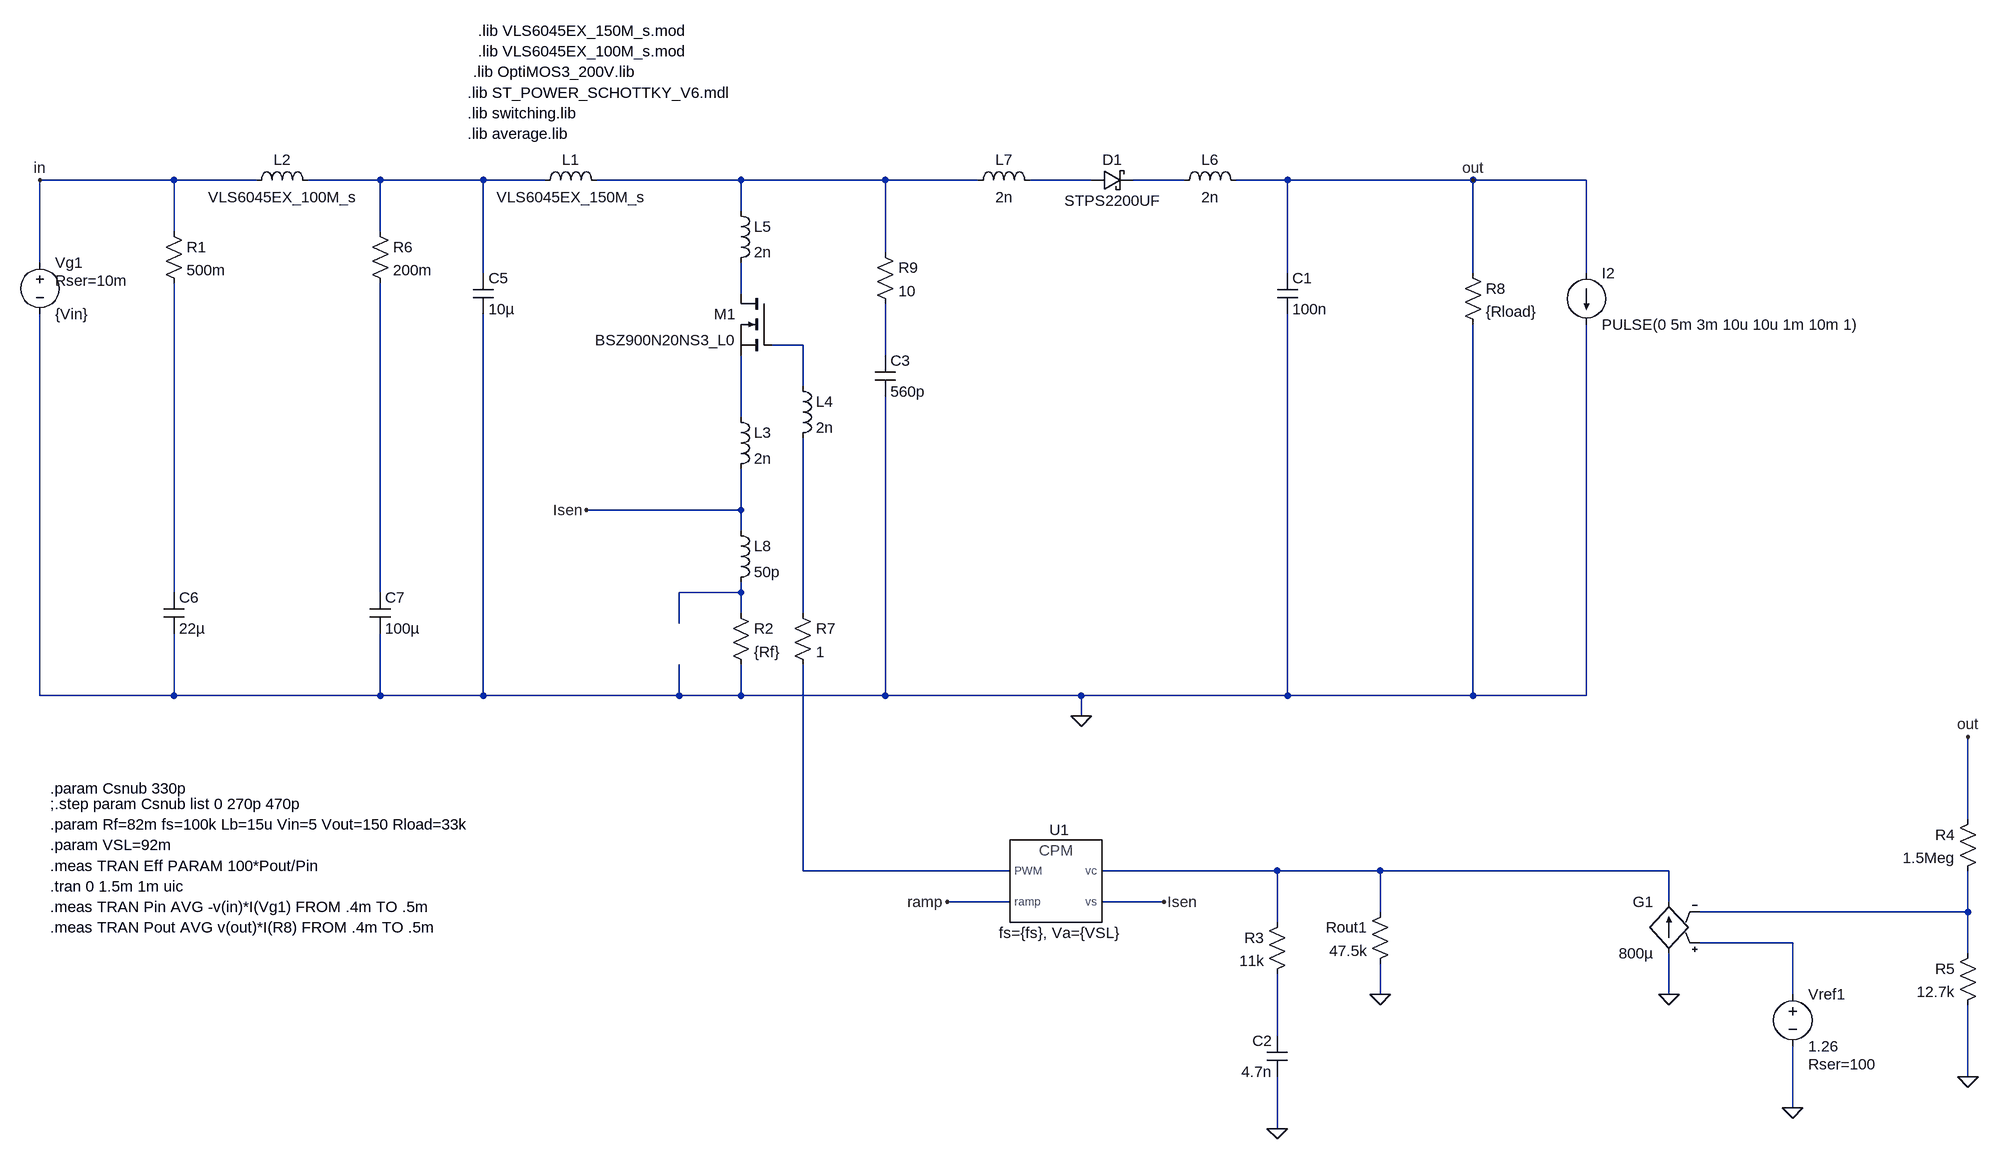
[diagram p0: schematic DCM CPM switching CL.asc]
DCM CPM switching CL.asc, the LTspice schematic file:
Version 4
SHEET 1 2048 1268
WIRE -1536 -224 -1744 -224
WIRE -1408 -224 -1536 -224
WIRE -1216 -224 -1328 -224
WIRE -1056 -224 -1216 -224
WIRE -960 -224 -1056 -224
WIRE -656 -224 -880 -224
WIRE -432 -224 -656 -224
WIRE -288 -224 -432 -224
WIRE -112 -224 -208 -224
WIRE 32 -224 -48 -224
WIRE 192 -224 112 -224
WIRE 480 -224 192 -224
WIRE 656 -224 480 -224
WIRE -656 -176 -656 -224
WIRE -1536 -144 -1536 -224
WIRE -1216 -144 -1216 -224
WIRE -432 -112 -432 -224
WIRE -1744 -96 -1744 -224
WIRE -1056 -80 -1056 -224
WIRE 192 -80 192 -224
WIRE 480 -80 480 -224
WIRE 656 -80 656 -224
WIRE -656 -48 -656 -96
WIRE -560 32 -608 32
WIRE -432 48 -432 -32
WIRE -560 96 -560 32
WIRE -656 144 -656 48
WIRE -656 288 -656 224
WIRE -656 288 -896 288
WIRE -656 320 -656 288
WIRE -1536 416 -1536 -64
WIRE -1216 416 -1216 -64
WIRE -656 416 -656 400
WIRE -656 416 -752 416
WIRE -656 448 -656 416
WIRE -560 448 -560 176
WIRE -752 464 -752 416
WIRE -1744 576 -1744 -16
WIRE -1536 576 -1536 480
WIRE -1536 576 -1744 576
WIRE -1216 576 -1216 480
WIRE -1216 576 -1536 576
WIRE -1056 576 -1056 -16
WIRE -1056 576 -1216 576
WIRE -752 576 -752 528
WIRE -752 576 -1056 576
WIRE -656 576 -656 528
WIRE -656 576 -752 576
WIRE -432 576 -432 112
WIRE -432 576 -656 576
WIRE -128 576 -432 576
WIRE 192 576 192 -16
WIRE 192 576 -128 576
WIRE 480 576 480 0
WIRE 480 576 192 576
WIRE 656 576 656 0
WIRE 656 576 480 576
WIRE -128 608 -128 576
WIRE 1248 768 1248 640
WIRE -560 848 -560 528
WIRE -240 848 -560 848
WIRE 176 848 -96 848
WIRE 336 848 176 848
WIRE 784 848 336 848
WIRE -240 896 -336 896
WIRE 0 896 -96 896
WIRE 784 896 784 848
WIRE 336 912 336 848
WIRE 1248 912 1248 848
WIRE 1248 912 832 912
WIRE 176 928 176 848
WIRE 976 960 832 960
WIRE 1248 976 1248 912
WIRE 336 1040 336 992
WIRE 784 1040 784 976
WIRE 976 1040 976 960
WIRE 176 1104 176 1008
WIRE 1248 1168 1248 1056
WIRE 976 1216 976 1120
WIRE 176 1248 176 1168
FLAG -128 608 0
FLAG -1744 -224 in
FLAG 480 -224 out
FLAG -896 288 Isen
FLAG 0 896 Isen
FLAG -336 896 ramp
FLAG 1248 1168 0
FLAG 1248 640 out
FLAG 976 1216 0
FLAG 784 1040 0
FLAG 336 1040 0
FLAG 176 1248 0
SYMBOL voltage -1744 -112 R0
WINDOW 123 0 0 Left 0
WINDOW 39 24 44 Left 2
SYMATTR SpiceLine Rser=10m
SYMATTR InstName Vg1
SYMATTR Value {Vin}
SYMBOL cap 176 -80 R0
SYMATTR InstName C1
SYMATTR Value 100n
SYMBOL ind -976 -208 R270
WINDOW 0 32 56 VTop 2
WINDOW 3 5 56 VBottom 2
SYMATTR InstName L1
SYMATTR Value VLS6045EX_150M_s
SYMATTR SpiceLine Rser=75m
SYMATTR Prefix X
SYMBOL CPM_modulator -160 880 M0
SYMATTR InstName U1
SYMATTR SpiceLine fs={fs}, Va={VSL}
SYMBOL nmos -608 -48 M0
SYMATTR InstName M1
SYMATTR Value BSZ900N20NS3_L0
SYMATTR Prefix X
SYMBOL schottky -112 -208 R270
WINDOW 0 32 32 VTop 2
WINDOW 3 0 32 VBottom 2
SYMATTR InstName D1
SYMATTR Value STPS2200UF
SYMATTR Description Diode
SYMATTR Type diode
SYMBOL res -672 432 R0
SYMATTR InstName R2
SYMATTR Value {Rf}
SYMBOL res 1264 752 M0
SYMATTR InstName R4
SYMATTR Value 1.5Meg
SYMBOL res 1264 960 M0
SYMATTR InstName R5
SYMATTR Value 12.7k
SYMBOL current 656 -80 R0
WINDOW 123 0 0 Left 0
WINDOW 39 0 0 Left 0
SYMATTR InstName I2
SYMATTR Value PULSE(0 5m 3m 10u 10u 1m 10m 1)
SYMBOL voltage 976 1024 R0
WINDOW 123 0 0 Left 0
WINDOW 39 24 124 Left 2
SYMATTR SpiceLine Rser=100
SYMATTR InstName Vref1
SYMATTR Value 1.26
SYMBOL g2 784 880 M0
SYMATTR InstName G1
SYMATTR Value 800µ
SYMATTR Value2 table=(-.175, -140u) (.138, 110u)
SYMBOL res 352 896 M0
SYMATTR InstName Rout1
SYMATTR Value 47.5k
SYMBOL res 192 912 M0
SYMATTR InstName R3
SYMATTR Value 11k
SYMBOL cap 192 1104 M0
SYMATTR InstName C2
SYMATTR Value 4.7n
SYMBOL cap -1072 -80 R0
SYMATTR InstName C5
SYMATTR Value 10µ
SYMBOL cap -1552 416 R0
SYMATTR InstName C6
SYMATTR Value 22µ
SYMATTR SpiceLine Rser=100m
SYMBOL res -1552 -160 R0
SYMATTR InstName R1
SYMATTR Value 500m
SYMBOL ind -1424 -208 R270
WINDOW 0 32 56 VTop 2
WINDOW 3 5 56 VBottom 2
SYMATTR InstName L2
SYMATTR Value VLS6045EX_100M_s
SYMATTR SpiceLine Rser=50m
SYMATTR Prefix X
SYMBOL cap -1232 416 R0
SYMATTR InstName C7
SYMATTR Value 100µ
SYMATTR SpiceLine Rser=45m
SYMBOL res -1232 -160 R0
SYMATTR InstName R6
SYMATTR Value 200m
SYMBOL res -576 432 R0
SYMATTR InstName R7
SYMATTR Value 1
SYMBOL res 464 -96 R0
SYMATTR InstName R8
SYMATTR Value {Rload}
SYMBOL ind -576 80 R0
SYMATTR InstName L4
SYMATTR Value 2n
SYMBOL ind -672 -192 R0
SYMATTR InstName L5
SYMATTR Value 2n
SYMBOL ind -304 -208 R270
WINDOW 0 32 56 VTop 2
WINDOW 3 5 56 VBottom 2
SYMATTR InstName L7
SYMATTR Value 2n
SYMBOL ind 16 -208 R270
WINDOW 0 32 56 VTop 2
WINDOW 3 5 56 VBottom 2
SYMATTR InstName L6
SYMATTR Value 2n
SYMBOL ind -672 304 R0
SYMATTR InstName L8
SYMATTR Value 50p
SYMBOL ind -672 128 R0
SYMATTR InstName L3
SYMATTR Value 2n
SYMBOL cap -448 48 R0
SYMATTR InstName C3
SYMATTR Value 560p
SYMBOL res -448 -128 R0
SYMATTR InstName R9
SYMATTR Value 10
TEXT -1080 -328 Left 2 !.lib switching.lib
TEXT -1080 -296 Left 2 !.lib average.lib
TEXT -1728 872 Left 2 !.tran 0 1.5m 1m uic
TEXT -1728 776 Left 2 !.param Rf=82m fs=100k Lb=15u Vin=5 Vout=150 Rload=33k
TEXT -1728 808 Left 2 !.param VSL=92m
TEXT -1080 -360 Left 2 !.lib ST_POWER_SCHOTTKY_V6.mdl
TEXT -1728 904 Left 2 !.meas TRAN Pin AVG -v(in)*I(Vg1) FROM .4m TO .5m
TEXT -1728 936 Left 2 !.meas TRAN Pout AVG v(out)*I(R8) FROM .4m TO .5m
TEXT -1728 840 Left 2 !.meas TRAN Eff PARAM 100*Pout/Pin
TEXT -1072 -392 Left 2 !.lib OptiMOS3_200V.lib
TEXT -1064 -424 Left 2 !.lib VLS6045EX_100M_s.mod
TEXT -1064 -456 Left 2 !.lib VLS6045EX_150M_s.mod
TEXT -1728 744 Left 2 !;.step param Csnub list 0 270p 470p
TEXT -1728 720 Left 2 !.param Csnub 330p

The netlist it stands for:
* DCM CPM switching CL.asc
Vg1 in 0 {Vin} Rser=10m
C1 out 0 100n
XL1 N001 N002 VLS6045EX_150M_s Rser=75m  ; pins A B
XU1 N014 Isen N013 ramp CPM_modulator fs={fs}, Va={VSL} Vcmax=5, Dmin=0, Dmax=0.9, Voffset=0  ; pins vc vs PWM ramp
XM1 N005 N006 N008 BSZ900N20NS3_L0  ; pins D G S
D1 N003 N004 STPS2200UF
R2 N011 0 {Rf}
R4 out N015 1.5Meg
R5 N015 0 12.7k
I2 out 0 PULSE(0 5m 3m 10u 10u 1m 10m 1)
Vref1 N016 0 1.26 Rser=100
G1 0 N014 N016 N015 800µ table=(-.175, -140u) (.138, 110u)
Rout1 N014 0 47.5k
R3 N014 N017 11k
C2 N017 0 4.7n
C5 N001 0 10µ
C6 N009 0 22µ Rser=100m
R1 in N009 500m
XL2 in N001 VLS6045EX_100M_s Rser=50m  ; pins A B
C7 N010 0 100µ Rser=45m
R6 N001 N010 200m
R7 N012 N013 1
R8 out 0 {Rload}
L4 N006 N012 2n
L5 N002 N005 2n
L7 N002 N003 2n
L6 N004 out 2n
L8 Isen N011 50p
L3 N008 Isen 2n
C3 N007 0 560p
R9 N002 N007 10
.model D D
.lib standard.dio
.lib switching.lib
.lib average.lib
.tran 0 1.5m 1m uic
.param Rf=82m fs=100k Lb=15u Vin=5 Vout=150 Rload=33k
.param VSL=92m
.lib ST_POWER_SCHOTTKY_V6.mdl
.meas TRAN Pin AVG -v(in)*I(Vg1) FROM .4m TO .5m
.meas TRAN Pout AVG v(out)*I(R8) FROM .4m TO .5m
.meas TRAN Eff PARAM 100*Pout/Pin
.lib OptiMOS3_200V.lib
.lib VLS6045EX_100M_s.mod
.lib VLS6045EX_150M_s.mod
;.step param Csnub list 0 270p 470p
.param Csnub 330p
.backanno
.end